# EAGLE design VALDIKLIS_v2.0_DIN (EAGLE 6.4)
DESIGNER: Alvydas@SauleVire.lt; REV: v2.0 DIN; TITLE: Universalus valdiklis šilumos ūkiui
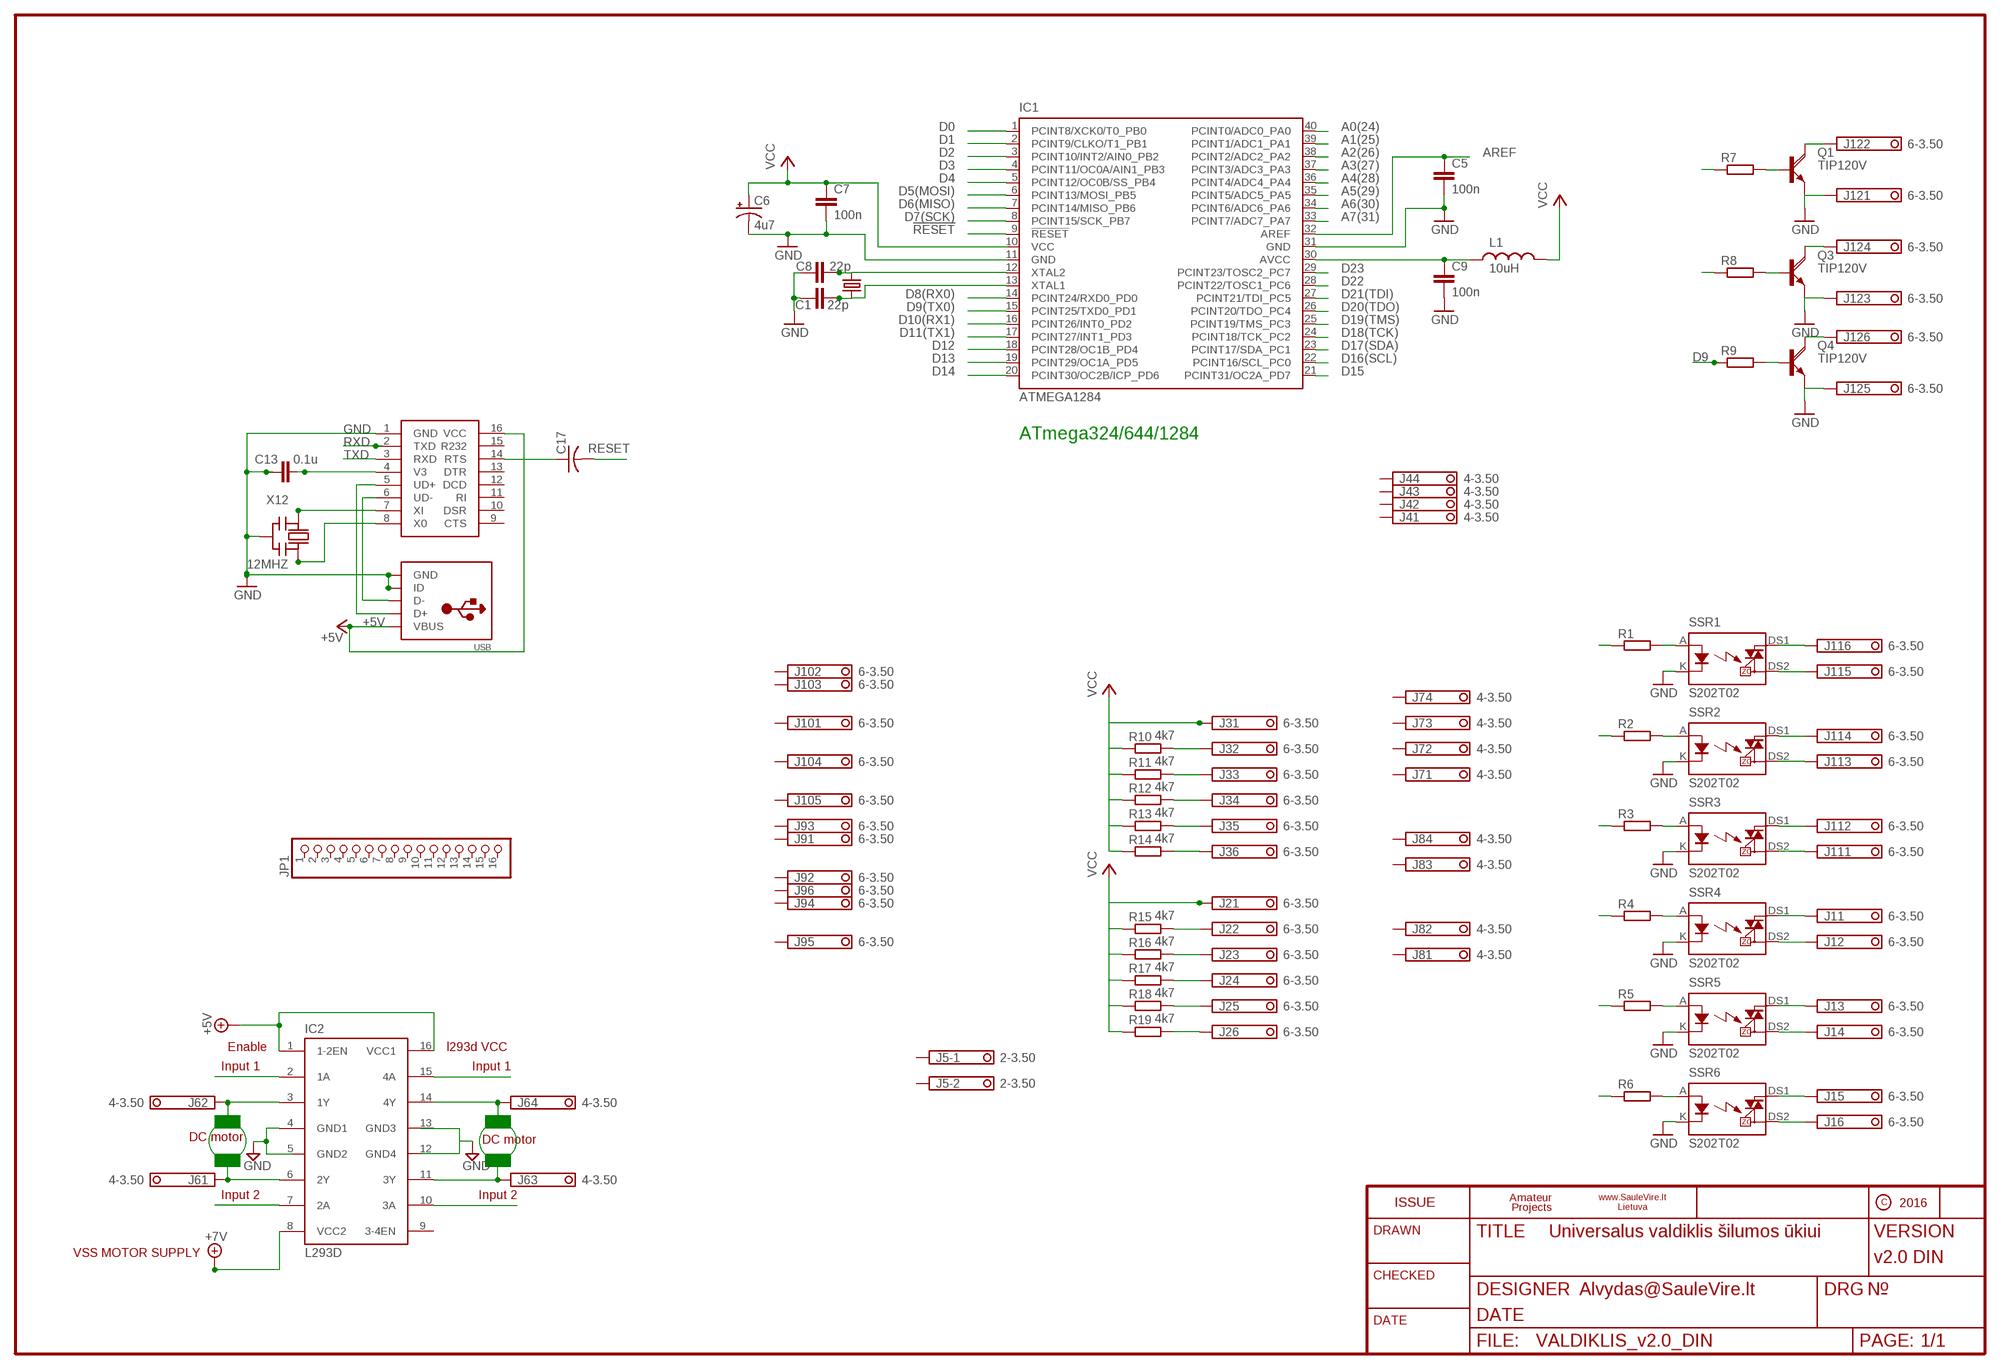
[diagram p0: schematic, sheet 1]

## Parts
C1  22p  C-EU025-024X044  [C025-024X044]
C5  100n  CAPPTH  [CAP-PTH-SMALL]
C6  4u7  CAP_POLPTH2  [CPOL-RADIAL-10UF-25V]
C7  100n  CAPPTH  [CAP-PTH-SMALL]
C8  22p  C-EU025-024X044  [C025-024X044]
C9  100n  CAPPTH  [CAP-PTH-SMALL]
C13  0.1u  C-EUC0805  [C0805]
C17  C-USC0805K  [C0805K]
IC1  ATMEGA1284  ATMEGA644-20PU  [DIL40]
IC2  L293D  [DIL16]
J1  6-3.50  [6-3.50]
J2  6-3.50  [6-3.50]
J3  6-3.50  [6-3.50]
J4  4-3.50  [4-3.50]
J5  2-3.50  [2-3.50]
J6  4-3.50  [4-3.50]
J7  4-3.50  [4-3.50]
J8  4-3.50  [4-3.50]
J9  6-3.50  [6-3.50]
J10  6-3.50  [6-3.50]
J11  6-3.50  [6-3.50]
J12  6-3.50  [6-3.50]
JP1  PINHD-1X16  [1X16]
L1  10uH  INDUCTOR0.4"-AXIAL  [RES-AXIAL-0.4]
Q1  TIP120V  [TO220AV]
Q3  TIP120V  [TO220AV]
Q4  TIP120V  [TO220AV]
R1  R-EU_0309/V  [0309V]
R2  R-EU_0309/V  [0309V]
R3  R-EU_0309/V  [0309V]
R4  R-EU_0309/V  [0309V]
R5  R-EU_0309/V  [0309V]
R6  R-EU_0309/V  [0309V]
R7  R-EU_0309/V  [0309V]
R8  R-EU_0309/V  [0309V]
R9  R-EU_0309/V  [0309V]
R10  4k7  R-EU_0309/V  [0309V]
R11  4k7  R-EU_0309/V  [0309V]
R12  4k7  R-EU_0309/V  [0309V]
R13  4k7  R-EU_0309/V  [0309V]
R14  4k7  R-EU_0309/V  [0309V]
R15  4k7  R-EU_0309/V  [0309V]
R16  4k7  R-EU_0309/V  [0309V]
R17  4k7  R-EU_0309/V  [0309V]
R18  4k7  R-EU_0309/V  [0309V]
R19  4k7  R-EU_0309/V  [0309V]
SSR1  S202T02  [S202T02]
SSR2  S202T02  [S202T02]
SSR3  S202T02  [S202T02]
SSR4  S202T02  [S202T02]
SSR5  S202T02  [S202T02]
SSR6  S202T02  [S202T02]
U$10  CH340G  [SO016]
USB  USBMOLEX  [USB-MINIB-THM-MOLEX]
X2  16MHz  CRYSTALHC49US  [HC49US]
X12  12MHZ  CERMOSCILL-THM  [CERM_OSC]

## Nets
!RESET: IC1.9(!RESET)
+5V: IC2.1(1-2EN) IC2.16(VCC1) U$10.16(VCC) USB.VBUS
+7V: IC2.8(VCC2)
A0(24): IC1.40(PCINT0/ADC0_PA0)
A1(25): IC1.39(PCINT1/ADC1_PA1)
A2(26): IC1.38(PCINT2/ADC2_PA2)
A3(27): IC1.37(PCINT3/ADC3_PA3)
A4(28): IC1.36(PCINT4/ADC4_PA4)
A5(29): IC1.35(PCINT5/ADC5_PA5)
A6(30): IC1.34(PCINT6/ADC6_PA6)
A7(31): IC1.33(PCINT7/ADC7_PA7)
AREF: C5.1 IC1.32(AREF)
AVCC [power]: C9.1 IC1.30(AVCC) L1.P$1
D0: IC1.1(PCINT8/XCK0/T0_PB0)
D1: IC1.2(PCINT9/CLKO/T1_PB1)
D2: IC1.3(PCINT10/INT2/AIN0_PB2)
D3: IC1.4(PCINT11/OC0A/AIN1_PB3)
D4: IC1.5(PCINT12/OC0B/SS_PB4)
D5(MOSI): IC1.6(PCINT13/MOSI_PB5)
D6(MISO): IC1.7(PCINT14/MISO_PB6)
D7(SCK): IC1.8(PCINT15/SCK_PB7)
D8(RX0): IC1.14(PCINT24/RXD0_PD0)
D9: R9.1
D9(TX0): IC1.15(PCINT25/TXD0_PD1)
D10(RX1): IC1.16(PCINT26/INT0_PD2)
D11(TX1): IC1.17(PCINT27/INT1_PD3)
D12: IC1.18(PCINT28/OC1B_PD4)
D13: IC1.19(PCINT29/OC1A_PD5)
D14: IC1.20(PCINT30/OC2B/ICP_PD6)
D15: IC1.21(PCINT31/OC2A_PD7)
D16(SCL): IC1.22(PCINT16/SCL_PC0)
D17(SDA): IC1.23(PCINT17/SDA_PC1)
D18(TCK): IC1.24(PCINT18/TCK_PC2)
D19(TMS): IC1.25(PCINT19/TMS_PC3)
D20(TDO): IC1.26(PCINT20/TDO_PC4)
D21(TDI): IC1.27(PCINT21/TDI_PC5)
D22: IC1.28(PCINT22/TOSC1_PC6)
D23: IC1.29(PCINT23/TOSC2_PC7)
GND: C1.1 C5.2 C6.2(-) C7.2 C8.1 C9.2 C13.1 IC1.11(GND) IC1.31(GND) IC2.4(GND1) J12.1 J12.3 J12.5 Q1.E Q3.E Q4.E SSR1.K SSR2.K SSR3.K SSR4.K SSR5.K SSR6.K U$10.1(GND) USB.GND USB.ID X12.P$2(GND)
N$2: IC2.14(4Y) J6.4
N$3: J6.3
N$4: IC2.10(3A)
N$5: IC2.15(4A)
N$6: J11.5 SSR1.DS2
N$7: Q1.B R7.2
N$8: R7.1
N$9: J11.6 SSR1.DS1
N$10: J11.4 SSR2.DS1
N$11: U$10.6(UD-) USB.D-
N$12: U$10.7(XI) X12.P$1(IN)
N$13: Q3.B R8.2
N$14: Q4.B R9.2
N$15: U$10.5(UD+) USB.D+
N$16: IC2.2(1A)
N$17: IC2.7(2A)
N$18: R1.2 SSR1.A
N$19: J11.3 SSR2.DS2
N$20: R2.2 SSR2.A
N$21: J11.2 SSR3.DS1
N$22: J11.1 SSR3.DS2
N$23: J1.6 SSR6.DS2
N$24: J1.5 SSR6.DS1
N$25: J1.4 SSR5.DS2
N$26: J1.3 SSR5.DS1
N$27: J1.2 SSR4.DS2
N$28: J1.1 SSR4.DS1
N$29: R1.1
N$30: R2.1
N$31: R3.2 SSR3.A
N$32: R3.1
N$33: R4.2 SSR4.A
N$34: R4.1
N$35: R5.1
N$36: R5.2 SSR5.A
N$37: R6.1
N$38: U$10.8(X0) X12.P$3(OUT)
N$39: R6.2 SSR6.A
N$40: C13.2 U$10.4(V3)
N$41: R8.1
N$42: J3.5 R13.2
N$43: C17.1 U$10.14(RTS)
N$44: J3.3 R11.2
N$45: J3.4 R12.2
N$46: J3.2 R10.2
N$48: J3.6 R14.2
N$49: J2.3 R16.2
N$50: J2.4 R17.2
N$51: J2.2 R15.2
N$53: J2.5 R18.2
N$54: J2.6 R19.2
N$65: J12.4 Q3.C
N$66: J12.6 Q4.C
N$67: J12.2 Q1.C
N$68: C1.2 IC1.13(XTAL1) X2.1
N$69: C8.2 IC1.12(XTAL2) X2.2
N$70: IC2.3(1Y) J6.2
N$71: IC2.6(2Y) J6.1
RESET: C17.2
RXD: U$10.2(TXD)
TXD: U$10.3(RXD)
VCC [power]: C6.1(+) C7.1 IC1.10(VCC) J2.1 J3.1 L1.P$2 R10.1 R11.1 R12.1 R13.1 R14.1 R15.1 R16.1 R17.1 R18.1 R19.1
Unconnected: IC2.9(3-4EN) IC2.11(3Y) J4.1 J4.2 J4.3 J4.4 J5.1 J5.2 J7.1 J7.2 J7.3 J7.4 J8.1 J8.2 J8.3 J8.4 J9.1 J9.2 J9.3 J9.4 J9.5 J9.6 J10.1 J10.2 J10.3 J10.4 J10.5 J10.6 JP1.1 JP1.2 JP1.3 JP1.4 JP1.5 JP1.6 JP1.7 JP1.8 JP1.9 JP1.10 JP1.11 JP1.12 JP1.13 JP1.14 JP1.15 JP1.16 U$10.9(CTS) U$10.10(DSR) U$10.11(RI) U$10.12(DCD) U$10.13(DTR) U$10.15(R232)

## Notes on the sheet
- ATmega324/644/1284
- Enable | l293d VCC
- Input 1 | Input 1
- DC motor
- DC motor
- Input 2 | Input 2
- VSS MOTOR SUPPLY

## Power pins joined to a net without a drawn wire
GND2: IC2.5(GND2)
GND3: IC2.13(GND3)
GND4: IC2.12(GND4)

## Library data of the parts
C1 C8 C13 = rcl:C-EU: CAPACITOR, European symbol
C5 C7 C9 = SparkFun:CAP: Capacitor Standard 0603 ceramic capacitor, and 0.1" leaded capacitor.
C6 = SparkFun:CAP_POL: Capacitor Polarized These are standard SMD and PTH capacitors. Normally 10uF, 47uF, and 100uF in electrolytic and tantalum varieties. Always verify the external diameter of the through hole cap, it varies with capacity, voltage, and manufacturer. The EIA devices should be standard.
C17 = rcl:C-US: CAPACITOR, American symbol
IC1 = SteveMarple:ATMEGA644-*PU: 8-bit Microcontroller with 64K Bytes In-System Programmable Flash Auto generated by make-symbol-device-package-bsdl.ulp Rev. 34 Source: http://www.atmel.com/dyn/resources/prod_documents/doc2593.pdf; MPN: ATMEGA644-20PU; OC_FARNELL: 1288340; OC_NEWARK: 23M5060
IC2 = st-microelectronics:L293D: PUSH-PULL 4 CHANNEL DRIVER
J1-J3 J9-J12 = con-phoenix-350-1:6-3.50
J4 J6-J8 = con-phoenix-350-1:4-3.50
J5 = con-phoenix-350-1:2-3.50
JP1 = pinhead:PINHD-1X16: PIN HEADER
L1 = SteveMarple:INDUCTOR: Inductors Basic Inductor/Choke - 0603 and 1206. Footprints are not proven and vary greatly between part numbers.
Q1 Q3 Q4 = rocketfarm:TIP120: NPN DARLINGTON TRANSISTOR
R1-R19 = resistor-1:R-EU_: RESISTOR, European symbol
SSR1-SSR6 = relay-1:S202T02
U$10 = ch340:CH340G: CH340G
USB = adafruit:USB: USB Connectors USBMINIB - Surface Mount Female Mini-B USB Connector 4UConnector: 06564 By microbuilder.eu Thru-hole RA Female Mini-B USB Connector 4UConnector: 18732 By ladyada.net
X2 = SparkFun:CRYSTAL: Crystals Various standard crystals. Proven footprints. Spark Fun Electronics SKU : COM-00534
X12 = adafruit:CERMOSCILL: Ceramic oscillator with built in capacitors such as ZTT-12MHz http://www.ladyada.net/library/eagle

## Net classes
0 default: width 0.5 mm
1 power: width 0.381 mm
4 gnd: width 0.5 mm
5 220v: width 0.5 mm

## Board
Valdiklis
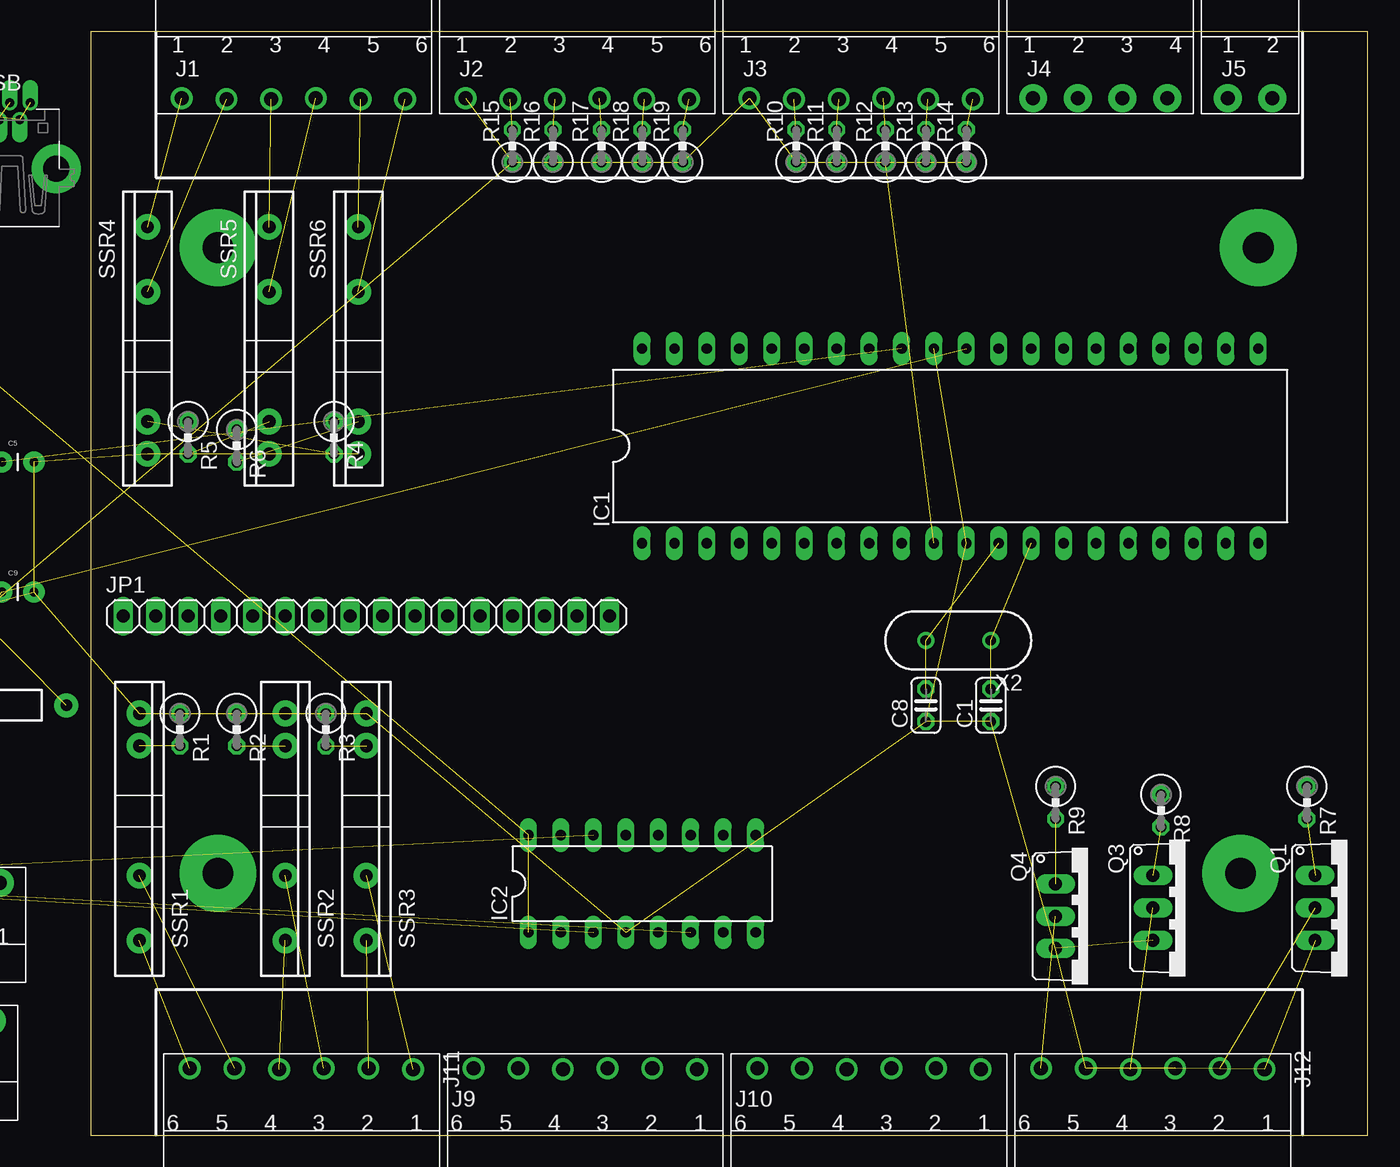
[diagram p1: board, top side]

Size 100 x 86.4 mm. Coordinates in mm from the lower left corner, seen from the top.
Outline: 0,0 100,0 100,86.4 0,86.4 0,0
Copper layers (1*16): Top 0.035mm / dielectric 1.5mm / Bottom 0.035mm
Design rules "default": minimum track width 10mil, minimum drill 24mil, track to track 8mil, track to pad 8mil, pad to pad 8mil, via to via 8mil, smd to smd 8mil, copper to edge 40mil, drill to drill 8mil, minimum pad ring 10mil, minimum via ring 8mil, stop-mask expansion 4mil, vias tented up to drill 0mil, thermal gap 10mil

### Footprints (pad centres in the part's own frame; a part is rotated, then mirrored left to right if it is on the bottom)
C025-024X044 = drill 0.813 octagon: 1 -1.27,0; 2 1.27,0
CAP-PTH-SMALL = drill 0.7 pad 1.651: 1 0,0; 2 2.54,0
CPOL-RADIAL-10UF-25V = drill 0.7 pad 1.651 square: 1 1.27,0 | drill 0.7 pad 1.651: 2 -1.27,0
C0805 = smd 1.3 x 1.5: 1 -0.95,0; 2 0.95,0
C0805K = smd 1.3 x 1.6: 1 -1,0; 2 1,0
DIL40 = drill 0.813 long: 1 -24.13,-7.62; 2 -21.59,-7.62; 3 -19.05,-7.62; 4 -16.51,-7.62; 5 -13.97,-7.62; 6 -11.43,-7.62; 7 -8.89,-7.62; 8 -6.35,-7.62; 9 -3.81,-7.62; 10 -1.27,-7.62; 11 1.27,-7.62; 12 3.81,-7.62; 13 6.35,-7.62; 14 8.89,-7.62; 15 11.43,-7.62; 16 13.97,-7.62; 17 16.51,-7.62; 18 19.05,-7.62; 19 21.59,-7.62; 20 24.13,-7.62; 21 24.13,7.62; 22 21.59,7.62; 23 19.05,7.62; 24 16.51,7.62; 25 13.97,7.62; 26 11.43,7.62; 27 8.89,7.62; 28 6.35,7.62; 29 3.81,7.62; 30 1.27,7.62; 31 -1.27,7.62; 32 -3.81,7.62; 33 -6.35,7.62; 34 -8.89,7.62; 35 -11.43,7.62; 36 -13.97,7.62; 37 -16.51,7.62; 38 -19.05,7.62; 39 -21.59,7.62; 40 -24.13,7.62
DIL16 = drill 0.813 long: 1 -8.89,-3.81; 2 -6.35,-3.81; 3 -3.81,-3.81; 4 -1.27,-3.81; 5 1.27,-3.81; 6 3.81,-3.81; 7 6.35,-3.81; 8 8.89,-3.81; 9 8.89,3.81; 10 6.35,3.81; 11 3.81,3.81; 12 1.27,3.81; 13 -1.27,3.81; 14 -3.81,3.81; 15 -6.35,3.81; 16 -8.89,3.81
6-3.50 = drill 1.1 pad 1.7: 1 2.05,1.2; 2 5.55,1.12; 3 9.05,1.12; 4 12.55,1.2; 5 16.05,1.12; 6 19.55,1.12
4-3.50 = drill 1.1 pad 2.184: 1 2.05,1.2; 2 5.55,1.2; 3 9.05,1.2; 4 12.55,1.2
2-3.50 = drill 1.1 pad 2.184: 1 2.05,1.2; 2 5.55,1.2
1X16 = drill 1.016 long: 1 -19.05,0; 2 -16.51,0; 3 -13.97,0; 4 -11.43,0; 5 -8.89,0; 6 -6.35,0; 7 -3.81,0; 8 -1.27,0; 9 1.27,0; 10 3.81,0; 11 6.35,0; 12 8.89,0; 13 11.43,0; 14 13.97,0; 15 16.51,0; 16 19.05,0
RES-AXIAL-0.4 = drill 0.9 pad 1.88: P$1 -5.08,0; P$2 5.08,0
TO220AV = drill 1.016 long: B -2.54,-2.54; C 0,-2.54; E 2.54,-2.54
0309V = drill 0.813 octagon: 1 -1.27,0; 2 1.27,0
S202T02 = drill 1 pad 2: A 10.16,0; DS1 -5.08,0; DS2 0,0; K 12.7,0
SO016 = smd 0.6 x 1.2: 1 -4.445,-2.8; 2 -3.175,-2.8; 3 -1.905,-2.8; 4 -0.635,-2.8; 5 0.635,-2.8; 6 1.905,-2.8; 7 3.175,-2.8; 8 4.445,-2.8; 9 4.445,2.8; 10 3.175,2.8; 11 1.905,2.8; 12 0.635,2.8; 13 -0.635,2.8; 14 -1.905,2.8; 15 -3.175,2.8; 16 -4.445,2.8
USB-MINIB-THM-MOLEX = drill 0.7 offset: D+ 0,9.72; D- -0.8,8.42; GND 1.6,9.72; ID 0.8,8.42; VBUS -1.6,9.72 | drill 2 pad 3.81: GND1 -3.65,4.57; GND4 3.65,4.57
HC49US = drill 0.813: 1 -2.54,0; 2 2.54,0
CERM_OSC = drill 0.813 pad 1.676: P$1 -2.54,0; P$2 0,0; P$3 2.54,0

### Placement (x,y rotation side)
C1  70.48,33.66 90 top
C5  -6.99,52.7 0 top  (outside the outline)
C6  -10.16,40.64 0 top  (outside the outline)
C7  -19.68,41.91 0 top  (outside the outline)
C8  65.41,33.66 90 top
C9  -6.99,42.55 0 top  (outside the outline)
C13  -19.05,81.28 0 top  (outside the outline)
C17  -25.4,76.2 0 top  (outside the outline)
IC1  67.31,53.98 0 top
IC2  43.18,19.68 0 top
J1  5.08,80.01 0 top
J2  27.3,80.01 0 top
J3  49.53,80.01 0 top
J4  71.75,80.01 0 top
J5  87,80.01 0 top
J6  -23.5,20.95 180 top  (outside the outline)
J7  -5.08,20.95 180 top  (outside the outline)
J8  -5.71,10.16 180 top  (outside the outline)
J9  49.53,6.35 180 top
J10  71.75,6.35 180 top
J11  27.3,6.35 180 top
J12  93.98,6.35 180 top
JP1  21.59,40.64 0 top
L1  -6.99,33.66 0 top
Q1  98.42,17.78 270 top
Q3  85.72,17.78 270 top
Q4  78.11,17.14 270 top
R1  6.99,31.75 270 top
R2  11.43,31.75 270 top
R3  18.41,31.75 270 top
R4  19.05,54.61 270 top
R5  7.62,54.61 270 top
R6  11.43,53.98 270 top
R7  95.25,26.04 270 top
R8  83.82,25.4 270 top
R9  75.56,26.04 270 top
R10  55.24,77.47 90 top
R11  58.42,77.47 90 top
R12  62.23,77.47 90 top
R13  65.41,77.47 90 top
R14  68.58,77.47 90 top
R15  33.02,77.47 90 top
R16  36.2,77.47 90 top
R17  40.01,77.47 90 top
R18  43.18,77.47 90 top
R19  46.35,77.47 90 top
SSR1  3.81,20.32 90 top
SSR2  15.24,20.32 90 top
SSR3  21.59,20.32 90 top
SSR4  4.45,66.04 270 top
SSR5  13.97,66.04 270 top
SSR6  20.95,66.04 270 top
U$10  -17.78,68.58 0 top  (outside the outline)
USB  -6.35,71.12 0 top
X2  67.94,38.73 180 top
X12  -25.4,59.69 0 top  (outside the outline)

### Tracks (layer width: path | path; a pad name or v marks a point on that pad's centre or on a via)
+5V  (3 unrouted)
AREF  (1 unrouted)
AVCC  (2 unrouted)
GND  (25 unrouted)
N$1  (via drill 2.4 pad 6)
  other vias: 9.95,20.5 90.05,20.5 91.44,69.5 9.95,69.5
N$2  (1 unrouted)
N$6  (1 unrouted)
N$7  (1 unrouted)
N$9  (1 unrouted)
N$10  (1 unrouted)
N$11  (1 unrouted)
N$12  (1 unrouted)
N$13  (1 unrouted)
N$14  (1 unrouted)
N$15  (1 unrouted)
N$18  (1 unrouted)
N$19  (1 unrouted)
N$20  (1 unrouted)
N$21  (1 unrouted)
N$22  (1 unrouted)
N$23  (1 unrouted)
N$24  (1 unrouted)
N$25  (1 unrouted)
N$26  (1 unrouted)
N$27  (1 unrouted)
N$28  (1 unrouted)
N$31  (1 unrouted)
N$33  (1 unrouted)
N$36  (1 unrouted)
N$38  (1 unrouted)
N$39  (1 unrouted)
N$40  (1 unrouted)
N$42  (1 unrouted)
N$43  (1 unrouted)
N$44  (1 unrouted)
N$45  (1 unrouted)
N$46  (1 unrouted)
N$48  (1 unrouted)
N$49  (1 unrouted)
N$50  (1 unrouted)
N$51  (1 unrouted)
N$53  (1 unrouted)
N$54  (1 unrouted)
N$65  (1 unrouted)
N$66  (1 unrouted)
N$67  (1 unrouted)
N$68  (2 unrouted)
N$69  (2 unrouted)
N$70  (1 unrouted)
N$71  (1 unrouted)
VCC  (15 unrouted)